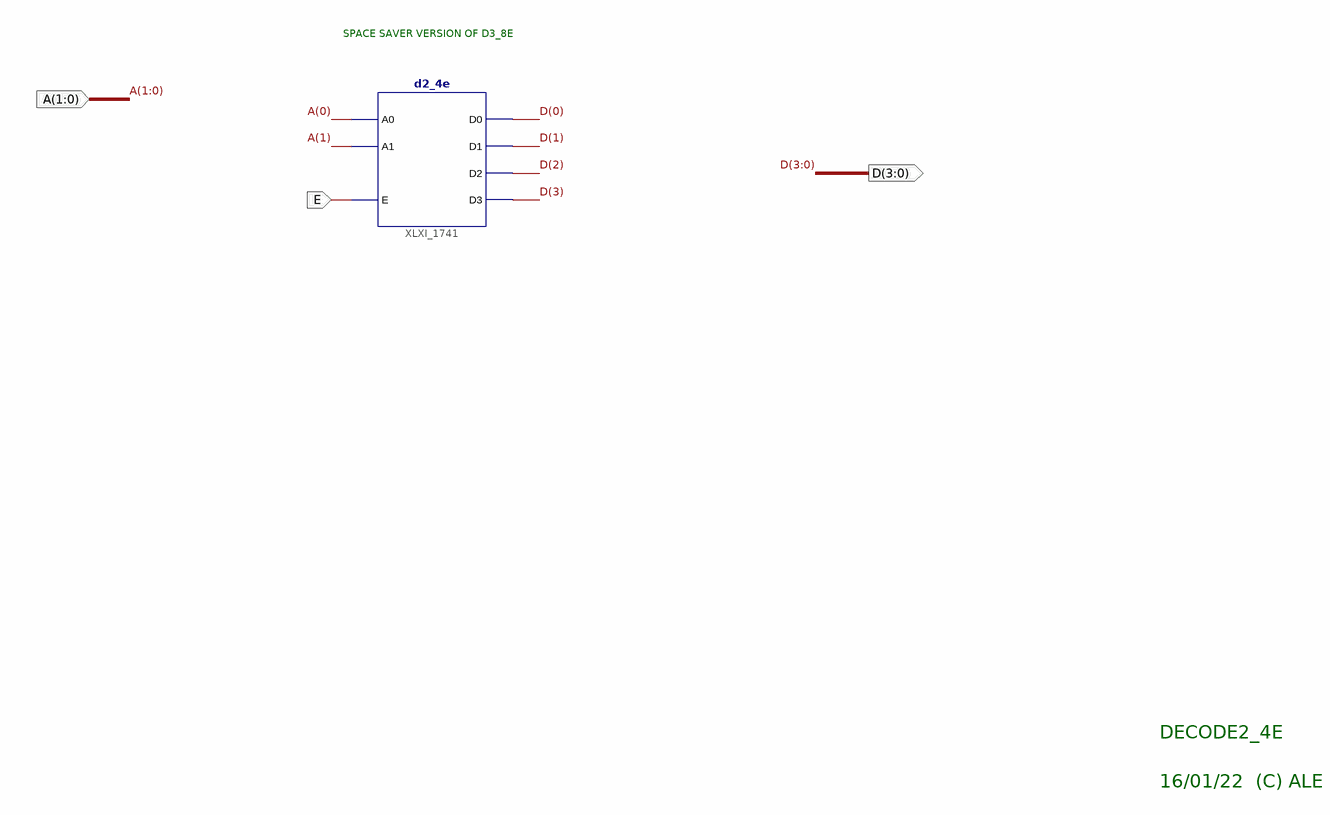
[diagram p0: schematic sheet 1]
// Xilinx ISE schematic Decode2_4E.sch (spartan3e) as structural Verilog: 1 symbols, 3 ports
module Decode2_4E (
  input  [1:0] A,
  input  E,
  output [3:0] D
);

  d2_4e XLXI_1741 (.A0(A[0]), .A1(A[1]), .E(E), .D0(D[0]), .D1(D[1]), .D2(D[2]), .D3(D[3]));

  // Notes on the sheet:
  //   SPACE SAVER VERSION OF D3_8E
  //   DECODE2_4E
  //   16/01/22  (C) ALE
endmodule
